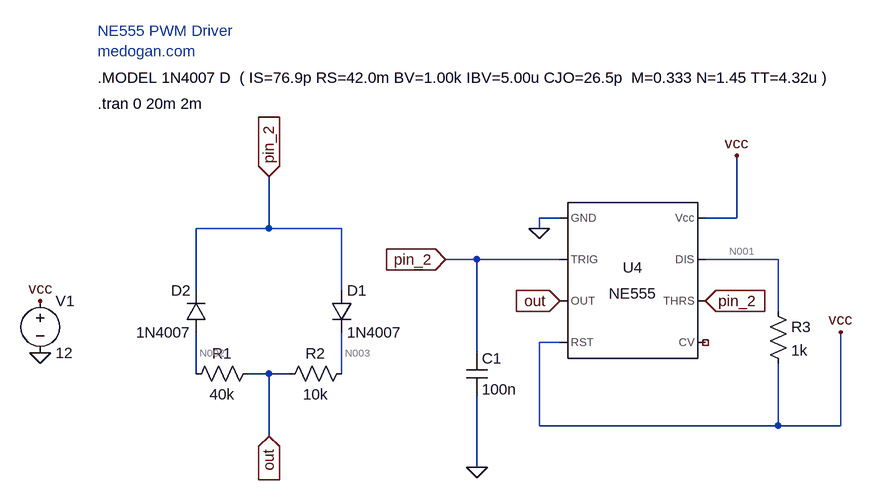
[diagram p0: schematic pwm.asc]
pwm.asc, the LTspice schematic file:
Version 4
SHEET 1 1000 680
WIRE -544 224 -576 224
WIRE -272 224 -272 128
WIRE -272 224 -320 224
WIRE -992 240 -992 160
WIRE -992 240 -1104 240
WIRE -880 240 -992 240
WIRE -576 240 -576 224
WIRE -672 288 -720 288
WIRE -544 288 -672 288
WIRE -208 288 -320 288
WIRE -1104 336 -1104 240
WIRE -880 336 -880 240
WIRE -208 368 -208 288
WIRE -544 416 -576 416
WIRE -672 432 -672 288
WIRE -1104 464 -1104 400
WIRE -992 464 -1024 464
WIRE -960 464 -992 464
WIRE -880 464 -880 400
WIRE -576 544 -576 416
WIRE -208 544 -208 448
WIRE -208 544 -576 544
WIRE -112 544 -112 400
WIRE -112 544 -208 544
WIRE -992 560 -992 464
WIRE -672 608 -672 496
FLAG -1344 432 0
FLAG -1344 352 vcc
FLAG -272 128 vcc
FLAG -576 240 0
FLAG -992 160 pin_2
IOPIN -992 160 In
FLAG -320 352 pin_2
IOPIN -320 352 In
FLAG -544 352 out
IOPIN -544 352 In
FLAG -992 560 out
IOPIN -992 560 In
FLAG -720 288 pin_2
IOPIN -720 288 In
FLAG -672 608 0
FLAG -112 400 vcc
SYMBOL Misc\\NE555 -432 320 R0
SYMATTR InstName U4
SYMBOL voltage -1344 336 R0
WINDOW 123 0 0 Left 0
WINDOW 39 0 0 Left 0
SYMATTR InstName V1
SYMATTR Value 12
SYMBOL res -1008 448 R90
WINDOW 0 0 56 VBottom 2
WINDOW 3 32 56 VTop 2
SYMATTR InstName R1
SYMATTR Value 40k
SYMBOL res -864 448 R90
WINDOW 0 0 56 VBottom 2
WINDOW 3 32 56 VTop 2
SYMATTR InstName R2
SYMATTR Value 10k
SYMBOL diode -896 336 R0
SYMATTR InstName D1
SYMATTR Value 1N4007
SYMBOL diode -1088 400 R180
WINDOW 0 24 64 Left 2
WINDOW 3 24 0 Left 2
SYMATTR InstName D2
SYMATTR Value 1N4007
SYMBOL res -224 352 R0
SYMATTR InstName R3
SYMATTR Value 1k
SYMBOL cap -688 432 R0
SYMATTR InstName C1
SYMATTR Value 100n
TEXT -1256 48 Left 2 !.tran 0 20m 2m
TEXT -1256 8 Left 2 !.MODEL 1N4007 D  ( IS=76.9p RS=42.0m BV=1.00k IBV=5.00u CJO=26.5p  M=0.333 N=1.45 TT=4.32u )
TEXT -1256 -64 Left 2 ;NE555 PWM Driver\nmedogan.com

The netlist it stands for:
* pwm.asc
XU4 0 pin_2 out vcc NC_01 pin_2 N001 vcc NE555  ; pins GND TRIG OUT RST CV THRS DIS Vcc
V1 vcc 0 12
R1 out N002 40k
R2 N003 out 10k
D1 pin_2 N003 1N4007
D2 N002 pin_2 1N4007
R3 N001 vcc 1k
C1 pin_2 0 100n
.model D D
.lib standard.dio
.tran 0 20m 2m
.MODEL 1N4007 D  ( IS=76.9p RS=42.0m BV=1.00k IBV=5.00u CJO=26.5p  M=0.333 N=1.45 TT=4.32u )
* NE555 PWM Driver
* medogan.com
.lib NE555.sub
.backanno
.end

* Results of the author's LTspice run, read from the files saved beside the schematic
* Operating Point, zero values left out:
*   V(pin_2) = 11.78 V
*   V(vcc) = 12 V
*   V(n001) = 12 V
*   V(out) = 12 V
*   V(n002) = 12 V
*   V(n003) = 12 V
*   I(D2) = 23.49 nA
*   I(D1) = -76.85 pA
*   I(R3) = -16.01 nA
*   I(R2) = -76.87 pA
*   I(R1) = 23.49 nA
*   I(V1) = -3.881 mA
*   Ix(u4:1) = -3.881 mA
*   Ix(u4:2) = 11.78 nA
*   Ix(u4:3) = -23.57 nA
*   Ix(u4:4) = 69.33 µA
*   Ix(u4:6) = 11.78 nA
*   Ix(u4:7) = 16.01 nA
*   Ix(u4:8) = 3.812 mA
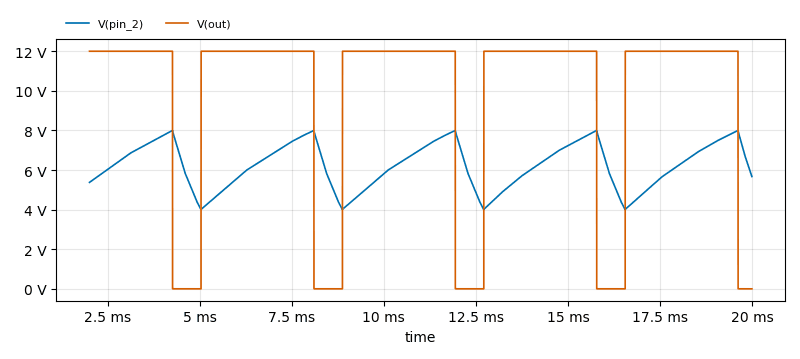
[diagram p1: Transient Analysis of pwm.asc, plotted from the saved traces]
* Transient Analysis, 1 run:
*   V(pin_2): min 3.999 V, max 8.001 V, average 6.233 V, rms 6.362 V, last 5.672 V
*   V(out): min 2.125 mV, max 12 V, average 9.679 V, rms 10.78 V, last 3.12 mV